# EAGLE design rapidshark-display-shifter-mk-2.0 (EAGLE 6.5.0)
AUTHOR: sean@yak.net
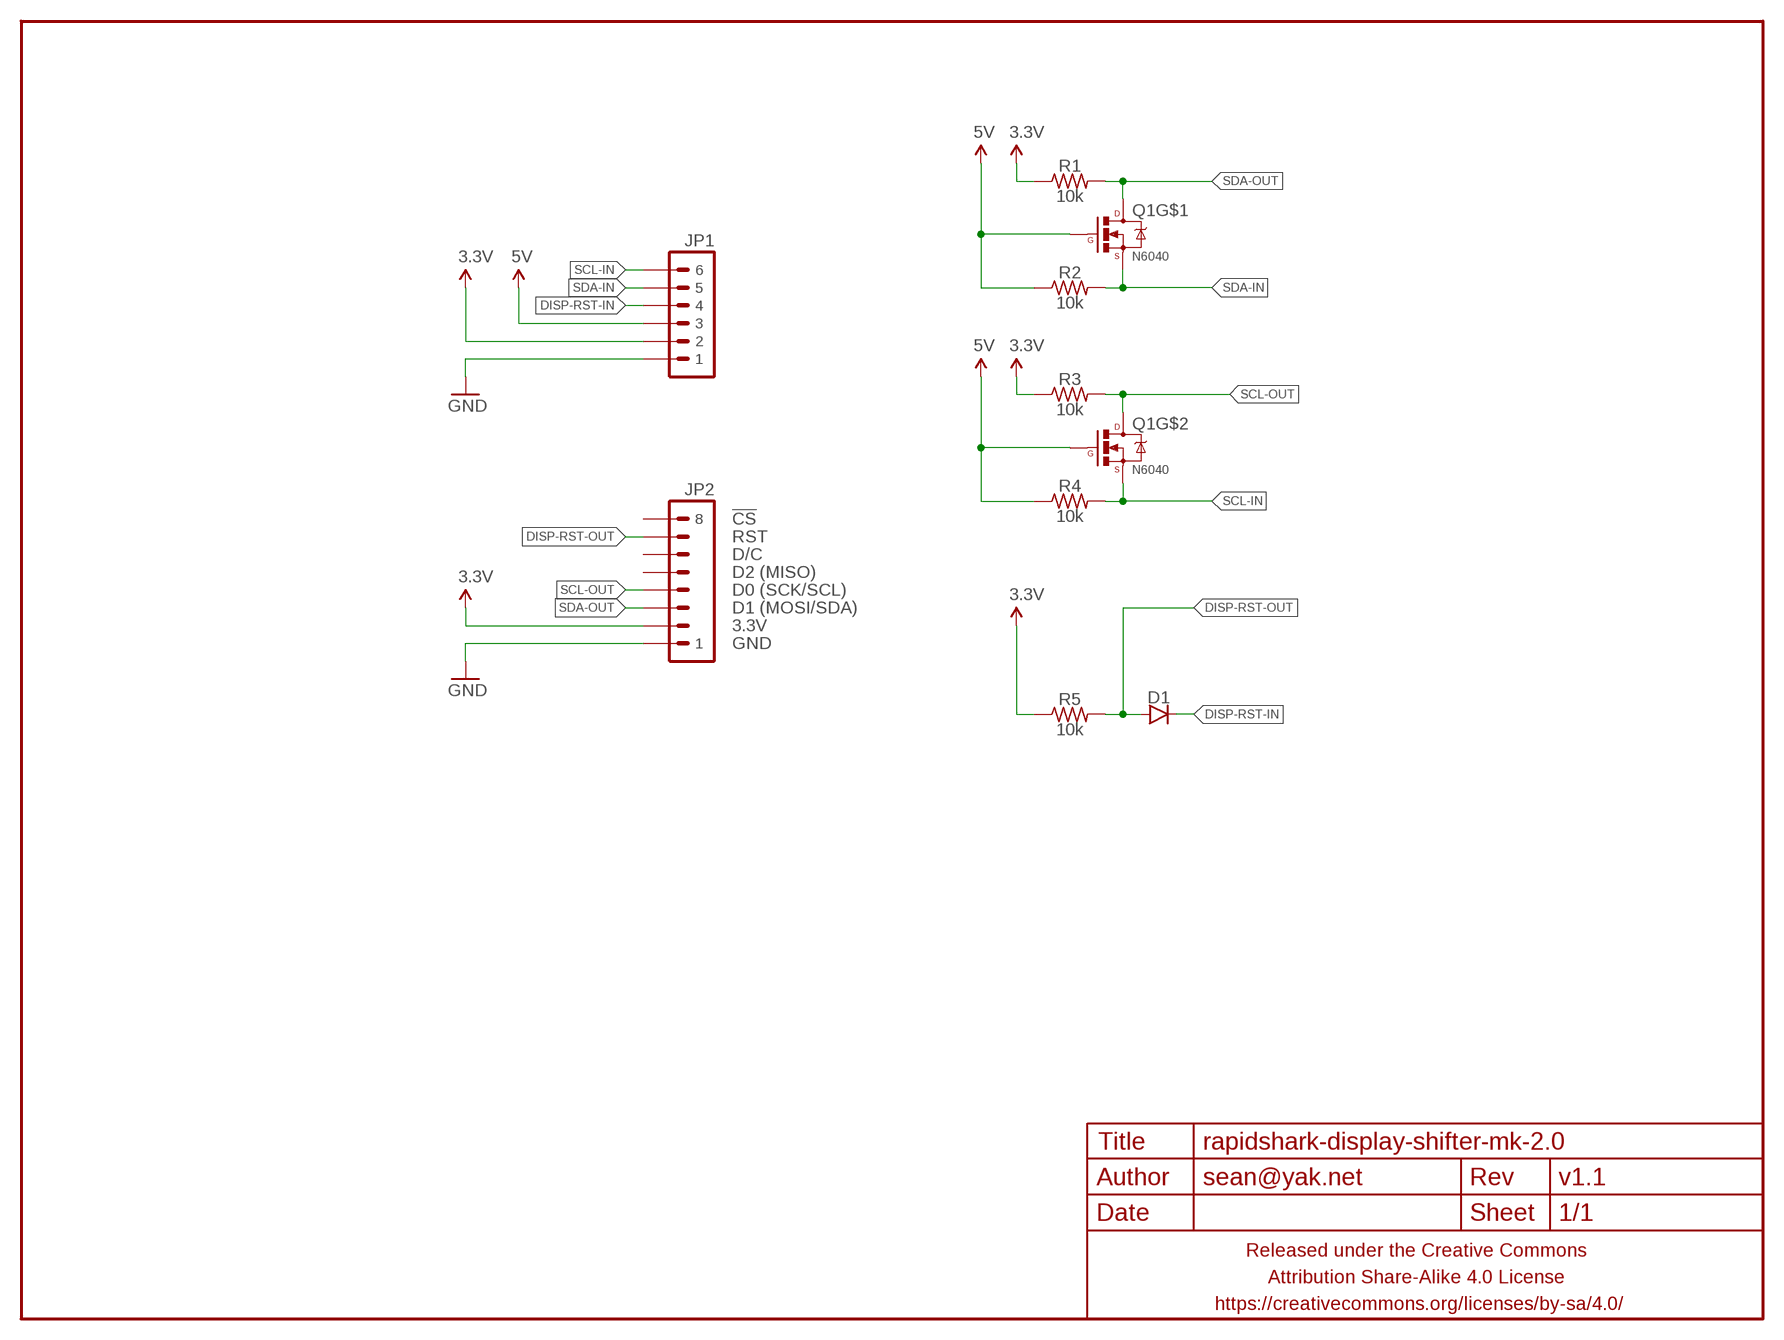
[diagram p0: schematic, sheet 1]

## Parts
D1  DIODESMA  [SMA-DIODE]
FRAME1  FRAME-LETTERNO_PACKAGE  [DUMMY]
JP1  M06JST-PH-PTH-VERT  [JST-6-PH-VERT-PTH]
JP2  M081X08  [1X08]
Q1  N6040  MOSFET-NCHANNEL-DUALSOIC8  [SO08]
R1  10k  RESISTORR0805  [R0805]
R2  10k  RESISTORR0805  [R0805]
R3  10k  RESISTORR0805  [R0805]
R4  10k  RESISTORR0805  [R0805]
R5  10k  RESISTORR0805  [R0805]

## Nets
3.3V: JP1.2 JP2.2 R1.1 R3.1 R5.1
5V: JP1.3 Q1.2(G) Q1.4(G) R2.1 R4.1
DISP-RST-IN: D1.C JP1.4
DISP-RST-OUT: D1.A JP2.7 R5.2
GND: JP1.1 JP2.1
SCL-IN: JP1.6 Q1.3(S) R4.2
SCL-OUT: JP2.4 Q1.5(D) Q1.6(D) R3.2
SDA-IN: JP1.5 Q1.1(S) R2.2
SDA-OUT: JP2.3 Q1.7(D) Q1.8(D) R1.2
Unconnected: JP2.5 JP2.6 JP2.8

## Notes on the sheet
- !CS
- RST
- D/C
- D2 (MISO)
- D0 (SCK/SCL)
- D1 (MOSI/SDA)
- 3.3V
- GND

## Library data of the parts
D1 = A_butts:DIODE: Diode These are standard reverse protection diodes and small signal diodes. SMA package can handle up to about 1A. SOD-323 can handle about 200mA. What the SOD-323 package when ordering, there are some mfgs out there that are 5-pin packages.
FRAME1 = A_butts:FRAME-LETTER: Schematic Frame Standard 8.5x11 US Letter frame; DESIGNER: sean@yak.net; VERSION: v1.1
JP1 = A_butts:M06: Header 6 Standard 6-pin 0.1" header. Use with straight break away headers (SKU : PRT-00116), right angle break away headers (PRT-00553), swiss pins (PRT-00743), machine pins (PRT-00117), and female headers (PRT-00115). Molex polarized connector foot print use with SKU : PRT-08094 with associated crimp pins and housings. NOTES ON THE VARIANTS LOCK and LOCK_LONGPADS... This footprint was designed to help hold the alignment of a through-hole component (i.e. 6-pin header) while soldering it into place. You may notice that each hole has been shifted either up or down by 0.005 of an inch from it's more standard position (which is a perfectly straight line). This slight alteration caused the pins (the squares in the middle) to touch the edges of the holes. Because they are alternating, it causes a "brace" to hold the component in place. 0.005 has proven to be the perfect amount of "off-center" position when using our standard breakaway headers. Although looks a little odd when you look at the bare footprint, once you have a header in there, the alteration is very hard to notice. Also,if you push a header all the way into place, it is covered up entirely on the bottom side. This idea of altering the position of holes to aid alignment will be further integrated into the Sparkfun Library for other footprints. It can help hold any component with 3 or more connection pins.
JP2 = A_butts:M08: Header 8 Standard 8-pin 0.1" header. Use with straight break away headers (SKU : PRT-00116), right angle break away headers (PRT-00553), swiss pins (PRT-00743), machine pins (PRT-00117), and female headers (PRT-00115).
Q1 = A_butts:MOSFET-NCHANNEL-DUAL
R1-R5 = A_butts:RESISTOR: RESISTOR, American symbol

## Board
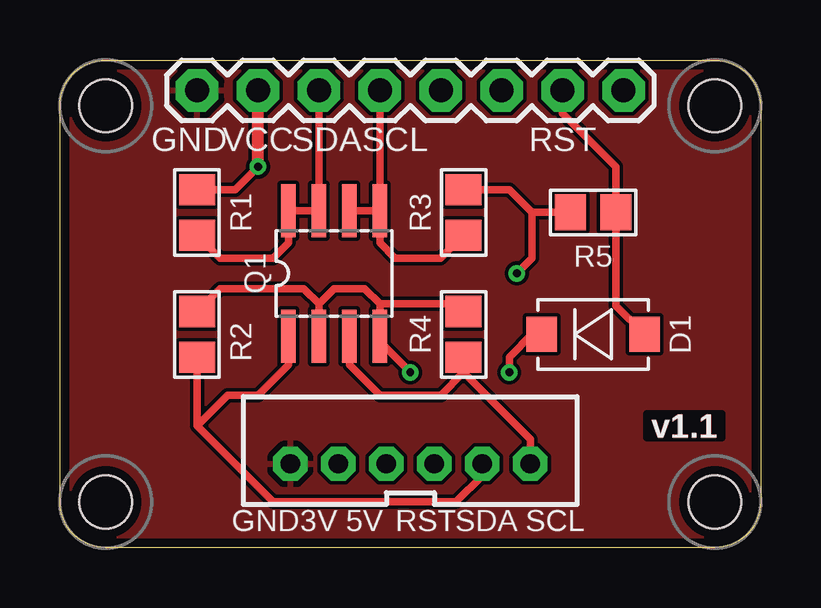
[diagram p1: board, top side]
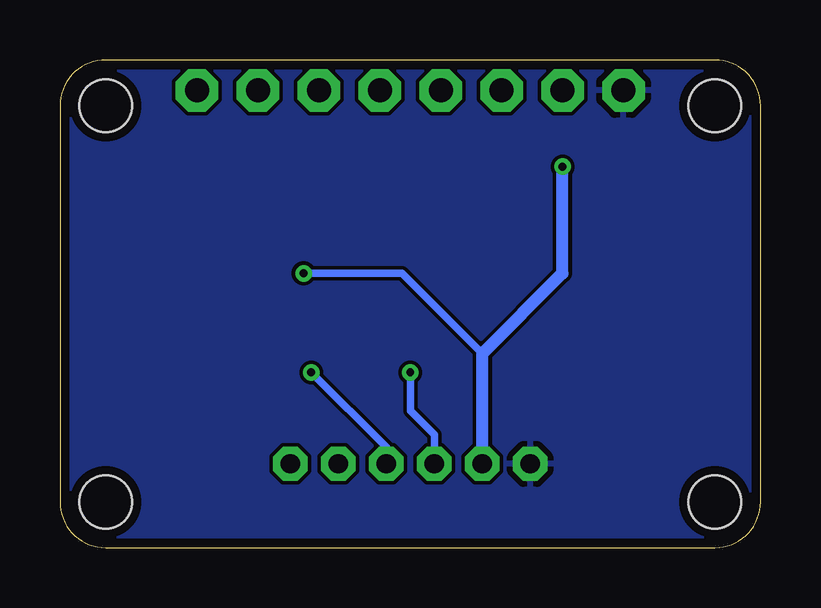
[diagram p2: board, bottom side, seen from below]

Size 29.21 x 20.32 mm. Coordinates in mm from the lower left corner, seen from the top.
Outline: 29.21,18.41 29.21,1.91 arc-90 27.3,0 1.91,0 arc-90 0,1.91 0,18.41 arc-90 1.91,20.32 27.3,20.32 arc-90 29.21,18.41
Copper layers (1*16): Top 0.0356mm / dielectric 1.5011mm / Bottom 0.0356mm
Design rules "LaenPCBOrder_2": minimum track width 6mil, minimum drill 13mil, track to track 6mil, track to pad 6mil, pad to pad 6mil, via to via 6mil, smd to smd 6mil, copper to edge 15mil, drill to drill 6mil, minimum pad ring 7mil, minimum via ring 7mil, stop-mask expansion 3mil, vias tented up to drill 20mil, thermal gap 10mil
Holes 2.2 mm at 1.91,18.41 27.3,18.41 27.3,1.91 1.91,1.91

### Footprints (pad centres in the part's own frame; a part is rotated, then mirrored left to right if it is on the bottom)
SMA-DIODE = smd 1.27 x 1.47: A -2.15,0; C 2.15,0
JST-6-PH-VERT-PTH = drill 0.8 pad 1.422 octagon: 1 -5,0; 2 -3,0; 3 -1,0; 4 1,0; 5 3,0; 6 5,0
1X08 = drill 1 pad 1.778 octagon: 1 0,0; 2 2.54,0; 3 5.08,0; 4 7.62,0; 5 10.16,0; 6 12.7,0; 7 15.24,0; 8 17.78,0
SO08 = smd 0.61 x 2.21: 1 -1.905,-2.616; 2 -0.635,-2.616; 3 0.635,-2.616; 4 1.905,-2.616; 5 1.905,2.616; 6 0.635,2.616; 7 -0.635,2.616; 8 -1.905,2.616
R0805 = smd 1.3 x 1.5: 1 -0.95,0; 2 0.95,0

### Placement (x,y rotation side)
D1  22.23,8.89 180 top
FRAME1  0,0 270 bottom
JP1  14.61,3.49 0 top
JP2  5.71,19.05 0 top
Q1  11.43,11.43 0 top
R1  5.71,13.97 270 top
R2  5.71,8.89 270 top
R3  16.83,13.97 270 top
R4  16.83,8.89 270 top
R5  22.23,13.97 0 top

### Tracks (layer width: path | path; a pad name or v marks a point on that pad's centre or on a via)
3.3V  (via drill 0.33)
  Top 0.305: R5.1 19.68,13.97 | 19.68,13.97 18.73,14.92 R3.1 | v19.05,11.43 19.68,12.06 19.68,13.97 | R1.1 7.3,14.92 v8.26,15.88
  Top 0.508: v8.26,15.88 JP2.2
  Bottom 0.305: v19.05,11.43 14.96,11.43 11.61,8.08
  Bottom 0.508: v8.26,15.88 8.26,11.43 11.61,8.08 JP1.2
5V  (via drill 0.33)
  Top 0.305: Q1.2 10.79,10.16 | 10.79,10.16 11.43,10.79 12.7,10.79 13.34,10.16 | 13.34,10.16 Q1.4 13.34,8.57 v14.61,7.3 | R4.1 16.51,10.16 13.34,10.16 | R2.1 6.67,10.79 10.16,10.79 10.79,10.16
  Bottom 0.305: JP1.3 13.61,4.71 14.61,5.71 v14.61,7.3
DISP-RST-IN  (via drill 0.33)
  Top 0.305: v18.73,7.3 18.73,7.94 19.68,8.89 D1.C
  Bottom 0.305: JP1.4 15.61,4.17 v18.73,7.3
DISP-RST-OUT
  Top 0.305: D1.A 23.18,10.09 R5.2 23.18,15.88 20.95,18.1 JP2.7
GND
  pour Top (rank 6): 29.21,18.41 29.21,1.91 arc-90 27.3,0 1.91,0 arc-90 0,1.91 0,18.41 arc-90 1.91,20.32 27.3,20.32 arc-90
  pour Bottom (rank 6): 29.21,18.41 29.21,1.91 arc-90 27.3,0 1.91,0 arc-90 0,1.91 0,18.41 arc-90 1.91,20.32 27.3,20.32 arc-90
SCL-IN
  Top 0.305: JP1.6 19.61,4.53 16.83,7.3 | Q1.3 12.06,7.62 13.34,6.35 15.88,6.35 16.83,7.3 | R4.2 16.83,7.3
SCL-OUT
  Top 0.305: JP2.4 13.34,14.29 | 13.34,14.29 Q1.5 13.34,12.7 13.97,12.06 15.87,12.06 R3.2 | Q1.6 13.09,14.05 13.34,14.29
SDA-IN
  Top 0.305: JP1.5 17.61,3 16.51,1.91 8.89,1.91 5.71,5.08 | 5.71,5.08 R2.2 | Q1.1 9.53,7.62 8.26,6.35 6.99,6.35 5.71,5.08
SDA-OUT
  Top 0.305: JP2.3 Q1.7 Q1.8 9.53,12.7 8.89,12.06 6.67,12.06 R1.2

### Text on the board
tPlace: GND | VCC | SDA | SCL | RST | GND | 3V | 5V | RST | SDA | SCL